# Altium schematic sheet FPGA_ADC_TOP.SchDoc
size A4
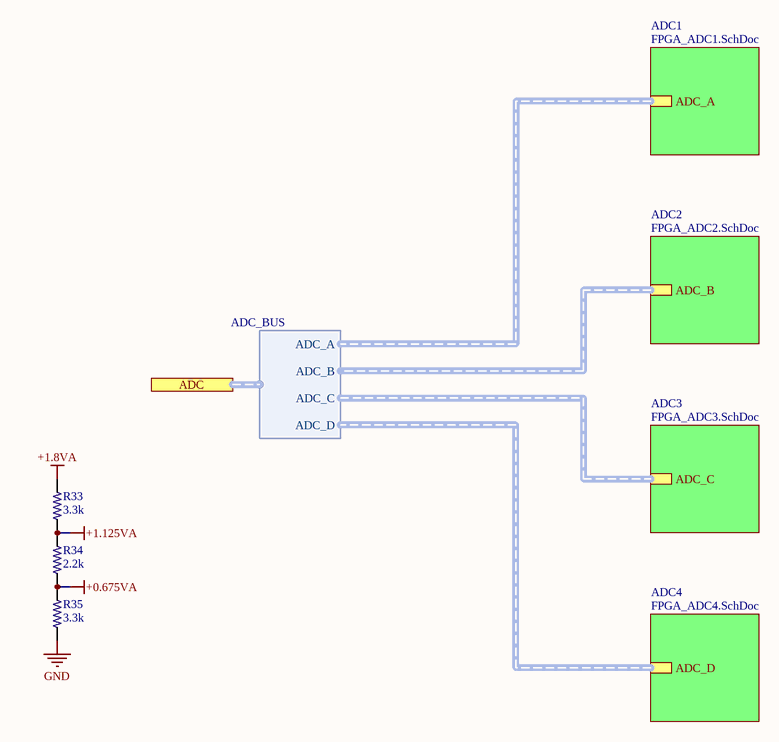
[diagram p0: FPGA_ADC_TOP.SchDoc]

## Parts
R33  value 3.3k  [R0603-HIGH-DENSITY]  (hidden comment: R0603 3.3k 1%)
R34  value 2.2k  [R0603-HIGH-DENSITY]  (hidden comment: R0603 2.2K 1%)
R35  value 3.3k  [R0603-HIGH-DENSITY]  (hidden comment: R0603 3.3k 1%)

## Sub-sheets
ADC1 = FPGA_ADC1.SchDoc: ADC_A (harness ADC)
ADC2 = FPGA_ADC2.SchDoc: ADC_B (harness ADC)
ADC3 = FPGA_ADC3.SchDoc: ADC_C (harness ADC)
ADC4 = FPGA_ADC4.SchDoc: ADC_D (harness ADC)

## Ports
ADC (harness ADC_BUS)

## Harnesses
ADC_BUS: ADC_A, ADC_B, ADC_C, ADC_D

## Nets
+0.675VA: R34.1 R35.2
+1.8VA: R33.2
+1.125VA: R33.1 R34.2
GND: R35.1

## Library data of the parts
R33 R35 = R0603 3.3k 1%: Chip Resistor, 0603, 3.3k ohms, 0.1W; Supplier 1: Digi-Key; Supplier Part Number 1: RMCF0603FT3K30CT-ND
R34 = R0603 2.2K 1%: RES SMD 2.2K OHM 1% 1/10W 0603; Temperature Coefficient: ±100ppm/°C; Features: Automotive AEC-Q200; Operating Temperature: -55°C ~ 155°C; Supplier 1: Digi-Key; Supplier Part Number 1: RMCF0603FT2K20CT-ND